# Altium schematic sheet DE-290817_02.SchDoc: Digital I/O - Power - Com
size A3; Author: eldar6776@hotmail.com; DrawnBy: Eldar Dedić; Organization: I-MEDIA GROUP d.o.o.; Address1: Topal Osman Paše 18; Address2: 71000 Sarajevo; Address3: Federacija BiH; Address4: Bosna i Hercegovina; DocumentNumber: 2; Revision: 001; SheetNumber: 2; SheetTotal: 2; DocumentName: DE-290817; ProjectName: Hotel Room Access Controller Unit
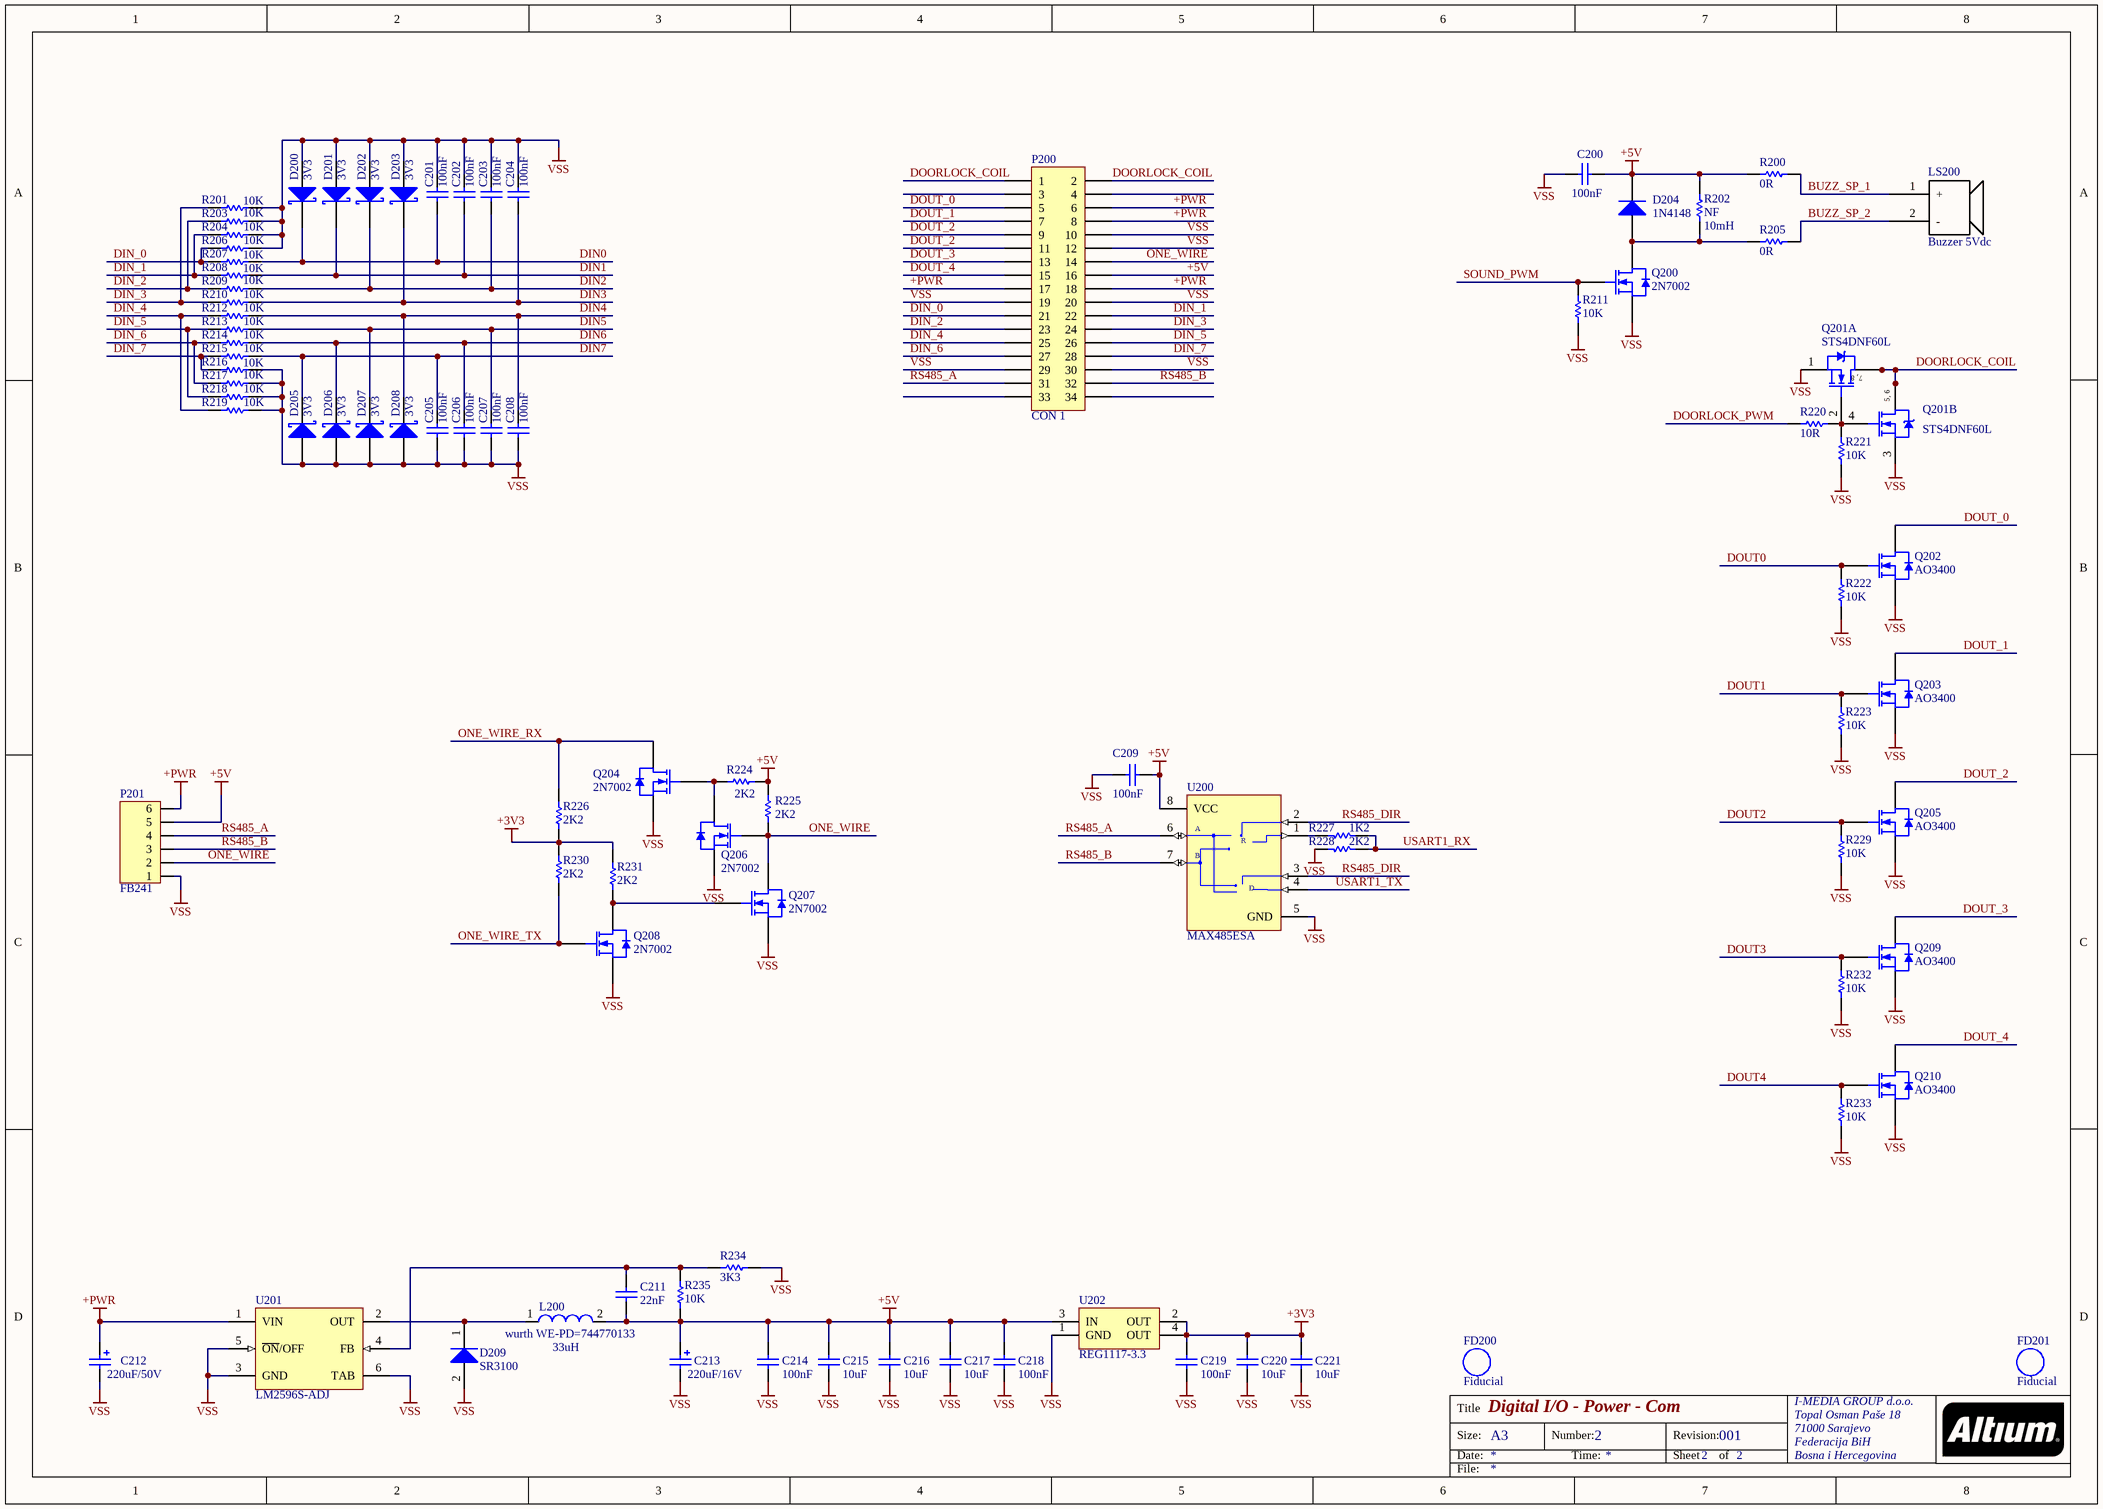
[diagram p0: DE-290817_02.SchDoc]

## Parts
C200  100nF  [0603]
C201  100nF  [0603]
C202  100nF  [0603]
C203  100nF  [0603]
C204  100nF  [0603]
C205  100nF  [0603]
C206  100nF  [0603]
C207  100nF  [0603]
C208  100nF  [0603]
C209  100nF  [0603]
C211  22nF  [0603]
C212  220uF/50V  [EEEHA1H101P]
C213  220uF/16V  [EEEHA1H101P]
C214  100nF  [0603]
C215  10uF  [0805]
C216  10uF  [0805]
C217  10uF  [0805]
C218  100nF  [0603]
C219  100nF  [0603]
C220  10uF  [0805]
C221  10uF  [0805]
D200  3V3  [SOD323]
D201  3V3  [SOD323]
D202  3V3  [SOD323]
D203  3V3  [SOD323]
D204  1N4148  [SOD323]
D205  3V3  [SOD323]
D206  3V3  [SOD323]
D207  3V3  [SOD323]
D208  3V3  [SOD323]
D209  SR3100  [ONSC-SMA-2-403D-02_C_V]
FD200  Fiducial  [Fiducial]  (no BOM)
FD201  Fiducial  [Fiducial]  (no BOM)
L200  wurth WE-PD=744770133  value 33uH  [WE-PD-XL]
LS200  Buzzer 5Vdc  [BUZZER]
P200  CON 1  [HDR2X17]
P201  FB241  [FB241_6]
Q200  2N7002  [SOT23_N]
Q201  STS4DNF60L  [ONSC-SOIC-8-751-07_V]  (parts A,B of 2)
Q202  AO3400  [SOT23_N]
Q203  AO3400  [SOT23_N]
Q204  2N7002  [SOT23_N]
Q205  AO3400  [SOT23_N]
Q206  2N7002  [SOT23_N]
Q207  2N7002  [SOT23_N]
Q208  2N7002  [SOT23_N]
Q209  AO3400  [SOT23_N]
Q210  AO3400  [SOT23_N]
R200  0R  [ERA-0603]
R201  10K  [ERA-0603]
R202  NF  value 10mH  [RD3.2x1.7]
R203  10K  [ERA-0603]
R204  10K  [ERA-0603]
R205  0R  [ERA-0603]
R206  10K  [ERA-0603]
R207  10K  [ERA-0603]
R208  10K  [ERA-0603]
R209  10K  [ERA-0603]
R210  10K  [ERA-0603]
R211  10K  [ERA-0603]
R212  10K  [ERA-0603]
R213  10K  [ERA-0603]
R214  10K  [ERA-0603]
R215  10K  [ERA-0603]
R216  10K  [ERA-0603]
R217  10K  [ERA-0603]
R218  10K  [ERA-0603]
R219  10K  [ERA-0603]
R220  10R  [ERA-0603]
R221  10K  [ERA-0603]
R222  10K  [ERA-0603]
R223  10K  [ERA-0603]
R224  2K2  [ERA-0603]
R225  2K2  [ERA-0603]
R226  2K2  [ERA-0603]
R227  1K2  [ERA-0603]
R228  2K2  [ERA-0603]
R229  10K  [ERA-0603]
R230  2K2  [ERA-0603]
R231  2K2  [ERA-0603]
R232  10K  [ERA-0603]
R233  10K  [ERA-0603]
R234  3K3  [ERA-0603]
R235  10K  [ERA-0603]
U200  MAX485ESA  [NSO8_M]
U201  LM2596S-ADJ  [TS5B_N]
U202  REG1117-3.3  [ZZ311]

## Nets
+3V3: C219.2 C220.2 C221.2 R226.1 R230.2 R231.2 U202.2(OUT) U202.4(OUT)
+5V: C200.1 C209.2 C211.1 C213.1 C214.2 C215.2 C216.2 C217.2 C218.2 D204.1(K) L200.2 P200.16 P201.5 R200.2 R202.2 R224.1 R225.2 R235.2 U200.8(VCC) U202.3(IN)
+PWR: C212.1 P200.6 P200.8 P200.17 P200.18 P201.6 U201.1(VIN)
VSS: C200.2 C201.1 C202.1 C203.1 C204.1 C205.1 C206.1 C207.1 C208.1 C209.1 C212.2 C213.2 C214.1 C215.1 C216.1 C217.1 C218.1 C219.1 C220.1 C221.1 D200.2(A) D201.2(A) D202.2(A) D203.2(A) D205.2(A) D206.2(A) D207.2(A) D208.2(A) D209.2(A) P200.10 P200.12 P200.19 P200.20 P200.29 P200.30 P201.1 Q200.2(S) Q201.1(S1) Q201.3(S2) Q202.2(S) Q203.2(S) Q204.2(S) Q205.2(S) Q206.2(S) Q207.2(S) Q208.2(S) Q209.2(S) Q210.2(S) R201.2 R203.2 R204.2 R206.2 R211.1 R216.2 R217.2 R218.2 R219.2 R221.2 R222.1 R223.1 R228.2 R229.1 R232.1 R233.1 R234.2 U200.5(GND) U201.3(GND) U201.5(~{ON}/OFF) U201.6(TAB) U202.1(GND)
BUZZ_SP_1: LS200.1(+) R200.1
BUZZ_SP_2: LS200.2(-) R205.1
DIN0: C201.2 D200.1(K) R207.2
DIN1: C202.2 D201.1(K) R208.2
DIN2: C203.2 D202.1(K) R209.2
DIN3: C204.2 D203.1(K) R210.2
DIN4: C208.2 D208.1(K) R212.2
DIN5: C207.2 D207.1(K) R213.2
DIN6: C206.2 D206.1(K) R214.2
DIN7: C205.2 D205.1(K) R215.2
DIN_0: P200.21 R206.1 R207.1
DIN_1: P200.22 R204.1 R208.1
DIN_2: P200.23 R203.1 R209.1
DIN_3: P200.24 R201.1 R210.1
DIN_4: P200.25 R212.1 R219.1
DIN_5: P200.26 R213.1 R218.1
DIN_6: P200.27 R214.1 R217.1
DIN_7: P200.28 R215.1 R216.1
DOORLOCK_COIL: P200.1 P200.2 Q201.5(D2) Q201.6(D2) Q201.7(D1) Q201.8(D1)
DOORLOCK_PWM: R220.2
DOUT0: Q202.1(G) R222.2
DOUT1: Q203.1(G) R223.2
DOUT2: Q205.1(G) R229.2
DOUT3: Q209.1(G) R232.2
DOUT4: Q210.1(G) R233.2
DOUT_0: P200.5 Q202.3(D)
DOUT_1: P200.7 Q203.3(D)
DOUT_2: P200.9 P200.11 Q205.3(D)
DOUT_3: P200.13 Q209.3(D)
DOUT_4: P200.15 Q210.3(D)
ONE_WIRE: P200.14 P201.2 Q206.1(G) Q207.3(D) R225.1
ONE_WIRE_RX: Q204.3(D) R226.2
ONE_WIRE_TX: Q208.1(G) R230.1
RS485_A: P200.31 P201.4 U200.6(A)
RS485_B: P200.32 P201.3 U200.7(B)
RS485_DIR: U200.2(~{RE}) U200.3(DE)
SOUND_PWM: Q200.1(G) R211.2
USART1_RX: R227.2 R228.1
USART1_TX: U200.4(DI)
NetC211_2: C211.2 R234.1 R235.1 U201.4(FB)
NetD204_2: D204.2(A) Q200.3(D) R202.1 R205.2
NetD209_1: D209.1(K) L200.1 U201.2(OUT)
NetQ201_2: Q201.2(G1) Q201.4(G2) R220.1 R221.1
NetQ204_1: Q204.1(G) Q206.3(D) R224.2
NetQ207_1: Q207.1(G) Q208.3(D) R231.1
NetR227_1: R227.1 U200.1(RO)

Not connected (* = marked no-connect by the designer): P200 3 4 33 34

## Notes on the sheet
- Title
- Size:
- Date:
- A3
- Number:
- Time:
- Revision:
- Sheet
- of
- File:
- (in symbol MAX485ESA) R; D
- (in symbol NVMD6N04R2G, part A) 7, 8
- (in symbol NVMD6N04R2G, part B) 5, 6

## Library data of the parts
C200-C209 C211 C214 C218 C219 = C0603: Ceramic Chip Capacitor - Standard; Note: Footprint corresponds to dimensions for bulk cassette packaging. This case size has tightened tolerances.; Published: 17-Jul-2002; LatestRevisionDate: 19-Mar-2004; LatestRevisionNote: Silkscreen size reduced.; DatasheetDocument: Mar-2001; PackageDocument: Mar-2001; PackageReference: 0603; Publisher: Altium Limited; Code_JEITA: 0603; Code_IPC: 1608 [0603]; ComponentLink1Description: Manufacturer Link; ComponentLink1URL: http://www.kemet.com/; ComponentLink2Description: Datasheet; ComponentLink2URL: http://www.kemet.com/kemet/web/homepage/kechome.nsf/vapubfilesname/F3102TA.pdf/$file/F3102TA.pdf
  C200-C209 C214 C218 C219: Value: 100nF
  C211: Value: 22nF
C212 = EEEHA1H101P: Aluminum Electrolytic Capacitors (SMD Type); Value: 220uF/50V
C213 = EEEHA1C221P: Aluminum Electrolytic Capacitors (SMD Type); Value: 220uF/16V
C215-C217 C220 C221 = C0805: Ceramic Chip Capacitor - Standard; Note: Footprint corresponds to dimensions for bulk cassette packaging. This case size has tightened tolerances.; Published: 17-Jul-2002; LatestRevisionDate: 19-Mar-2004; LatestRevisionNote: Silkscreen size reduced.; DatasheetDocument: Mar-2001; PackageDocument: Mar-2001; PackageReference: 0805; Publisher: Altium Limited; Code_JEITA: 0805; Code_IPC: 2012[0805]; ComponentLink1Description: Manufacturer Link; ComponentLink1URL: http://www.kemet.com/; ComponentLink2Description: Datasheet; ComponentLink2URL: http://www.kemet.com/kemet/web/homepage/kechome.nsf/vapubfilesname/F3102TA.pdf/$file/F3102TA.pdf; Value: 10uF
D200-D203 D205-D208 = 1PS76SB10: Schottky Barrier Diode; Published: 17-Sep-2003; LatestRevisionDate: 19-Mar-2004; LatestRevisionNote: Silkscreen size reduced.; DatasheetVersion: 14-Oct-1996; PackageVersion: May-1999; PackageReference: SOD323; Publisher: Altium Limited; PackageDescription: SOD-323/SC-76; 2 Leads; Body 1.7 x 1.3 mm, (LxW); ComponentLink1Description: Manufacturer Link; ComponentLink1URL: http://www.semiconductors.philips.com/; ComponentLink2Description: Datasheet; ComponentLink2URL: http://www.semiconductors.philips.com/acrobat/datasheets/1PS76SB10_2.pdf
D204 = BAS321: General-purpose Diode; Published: 17-Sep-2003; LatestRevisionDate: 19-Mar-2004; LatestRevisionNote: Silkscreen size reduced.; DatasheetVersion: 9-Feb-1999; PackageVersion: May-1999; PackageReference: SOD323; Publisher: Altium Limited; PackageDescription: SOD-323/SC-76; 2 Leads; Body 1.7 x 1.3 mm, (LxW); ComponentLink1Description: Manufacturer Link; ComponentLink1URL: http://www.semiconductors.philips.com/; ComponentLink2Description: Datasheet; ComponentLink2URL: http://www.semiconductors.philips.com/acrobat/datasheets/BAS321_2.pdf; Value: 1N4148
D209 = MBRA320T3G: Schottky Power Rectifier, 2-Pin SMA, Pb-Free, Tape and Reel; Manufacturer: On Semiconductor; Configuration: Single; IFSM Max (A): 80; DatasheetVersion: Rev. 0; PackageVersion: Rev. C, 08/2005; PackageReference: SMA-2-403D-02_C; PackageDescription: 2-Pin Small Molded Package, J-Bend Lead, Body 4.315 x 2.605 mm; Supplier 1: Digi-Key; Supplier Part Number 1: MBRA320T3GOSTR-ND; Supplier 2: Digi-Key; Supplier Part Number 2: MBRA320T3GOSCT-ND; Supplier 3: Digi-Key; Supplier Part Number 3: MBRA320T3GOSDKR-ND; Supplier 4: Farnell; Supplier Part Number 4: 2101200; Supplier 5: Newark; Supplier Part Number 5: 95M6589; Supplier 6: Mouser; Supplier Part Number 6: 863-MBRA320T3G; Packing: Tape and Reel; RoHS: TRUE; Mounting Technology: Surface Mount; PartNumber: MBRA320T3G; ComponentLink1Description: Manufacturer URL; ComponentLink1URL: http://www.onsemi.com/; ComponentLink2Description: Datasheet; ComponentLink2URL: http://www.onsemi.cn/pub_link/Collateral/MBRA320-D.PDF; ComponentLink3Description: Package Specification; ComponentLink3URL: http://www.onsemi.com/pub_link/Collateral/MBRA320-D.PDF; Value: SR3100
FD200 FD201 = Fiduchial: Fiduchial mark
L200 = 744770133: SMD-Shielded Power Inductor WE-PD, L = 33 µH; Inductance: 33.0 µH; DatasheetVersion: ver 5, Oct-2004; PackageReference: WE-PD-XL; PackageDescription: SMD Inductor, 2-Leads, Body 12.0 x 12.0 mm; PartNumber: 744770133; ComponentLink1Description: Manufacturer URL; ComponentLink1URL: http://www.we-online.com; ComponentLink2Description: Datasheet; ComponentLink2URL: http://www.we-online.de/katalog/media/pdf/744770133.pdf
LS200 = BUZZER: 5Vdc PCB buzzer
P200 = Header 17X2: Header, 17-Pin, Dual row; LatestRevisionDate: 17-Jul-2002; LatestRevisionNote: Re-released for DXP Platform.; Publisher: Altium Limited
P201 = TERMINAL BLOCK 6: PCB MOUNT TERMINAL BLOCK 2.5MM PITCH
Q200 Q202 Q203 Q205 Q209 Q210 = 2N7002: N-channel Enhancement Mode Field-effect Transistor; Published: 17-Sep-2003; LatestRevisionDate: 12-Dec-2006; LatestRevisionNote: IPC-7351 Footprint Added.; DatasheetVersion: 27-Jul-2000; PackageVersion: May-1999; PackageReference: SOT23; Publisher: Altium Limited; PackageDescription: 3-Pin SOT-23 Package 0.95 mm Pitch, 2.3 mm Lead Span; ComponentLink1Description: Manufacturer Link; ComponentLink1URL: http://www.semiconductors.philips.com/; ComponentLink2Description: Datasheet; ComponentLink2URL: http://www.semiconductors.philips.com/acrobat/datasheets/2N7002_4.pdf
  Q200: Value: 2N7002
Q201 = NVMD6N04R2G: Power MOSFET, 40 V, 5.8 A, Dual N-Channel, 8-Pin SOIC, Pb-Free, Tape and Reel; Manufacturer: On Semiconductor; Channel Polarity: N Channel; Ciss Typ (pF): 723; Coss Typ (pF): 156; Crss Typ (pF): 53; ID Max (A): 5.8; Qrr Typ (nC): 20; V(BR)DSS Min (V): 40; VGS(th) Max (V): 3; DatasheetVersion: Rev. 2; PackageVersion: Rev. AK, 02/2011; PackageReference: SOIC-8-751-07; PackageDescription: 8-Pin Small Outline Integrated Circuit, Body 4.9 x 3.9 mm, Pitch 1.27 mm; Configuration: Dual; Package Type: SOIC-8; Packing: Tape and Reel; RoHS: Pb-Free; VGS Max (V): 20; Mounting Technology: Surface Mount; PartNumber: NVMD6N04R2G; ComponentLink1Description: Manufacturer URL; ComponentLink1URL: http://www.onsemi.com/; ComponentLink2Description: Datasheet; ComponentLink2URL: http://www.onsemi.com/pub_link/Collateral/NTMD6N04R2-D.PDF; ComponentLink3Description: Package Specification; ComponentLink3URL: http://www.onsemi.com/pub_link/Collateral/751-07.PDF
Q204 Q206-Q208 = BSS123: N-channel Enhancement Mode Vertical D-MOSFET; Published: 17-Sep-2003; LatestRevisionDate: 12-Dec-2006; LatestRevisionNote: IPC-7351 Footprint Added.; DatasheetVersion: Apr-1995; PackageVersion: May-1999; PackageReference: SOT23; Publisher: Altium Limited; PackageDescription: 3-Pin SOT-23 Package 0.95 mm Pitch, 2.3 mm Lead Span; ComponentLink1Description: Manufacturer Link; ComponentLink1URL: http://www.semiconductors.philips.com/; ComponentLink2Description: Datasheet; ComponentLink2URL: http://www.semiconductors.philips.com/acrobat/datasheets/BSS123_3.pdf
R200 R201 R203-R235 = ERAV: Metal Film Thermosensitive Chip Resistor, 0.56 Ohm to 10k Ohm Range, 5% Tolerance, 0603 Size, 0.063 W; Note: If flow soldering, adjust pad width of PCB Footprint to 0.7 - 0.8 times the width of the resistor.; Published: 17-Dec-2003; LatestRevisionDate: 19-Mar-2004; LatestRevisionNote: Silkscreen size reduced.; PackageDocument: Mar-2003; PackageReference: ERA-0603; Publisher: Altium Limited; Code_IPC: 1608 [0603]; ComponentLink1Description: Manufacturer Link; ComponentLink1URL: http://www.panasonic.com/industrial/components/resistive_products.htm; ComponentLink2Description: Datasheet; ComponentLink2URL: http://www.panasonic.com/industrial/components/pdf/AOF0000CE1.pdf
  R200 R205: Value: 0R
  R211 R221-R223 R229 R232 R233: Value: 10K
  R220: Value: 10R
  R224 R225 R228 R230 R231: Value: 2K2
  R227: Value: 1K2
R202 = ERD6FC: Flame-Retardant Fuse Type Carbon Film Resistor, 4.7 Ohm to 1k Ohm Range, 2% and 5% Tolerance, 0.166 W; Published: 17-Dec-2003; PackageReference: RD3.2x1.7; Publisher: Altium Limited; ComponentLink1Description: Manufacturer Link; ComponentLink1URL: http://www.panasonic.com/industrial/components/resistive_products.htm; ComponentLink2Description: Datasheet; ComponentLink2URL: http://www.panasonic.com/industrial/components/pdf/AOB0000CE5.pdf
U200 = MAX485ESA: Low-Power, Slew-Rate-Limited RS-485/RS-422 Transceiver; Published: 16-Jan-2001; LatestRevisionDate: 13-Apr-2006; LatestRevisionNote: IPC-7351 Footprint Added.; DatasheetVersion: Feb-1996; PackageReference: NSO8; Publisher: Altium Limited; PackageDescription: 8-Pin Small Outline Integrated Circuit 1.27 mm Pitch; Code_JEDEC: MS-012-AA; Code_IPC: SOIC127P600-8; ComponentLink1Description: Manufacturer Link; ComponentLink1URL: http://www.maxim-ic.com/; ComponentLink2Description: Datasheet; ComponentLink2URL: http://pdfserv.maxim-ic.com/en/ds/MAX1487-MAX491.pdf
U201 = LM2596S-ADJ: SIMPLE SWITCHER® Power Converter 150 KHz 3A Step-Down Voltage Regulator, 5-pin TO-263; Manufacturer: National Semiconductor; PackageTopMarking: NSUZXYTTE#*LM2596S*-ADJ P+; PowerWise: N; High-Reliability: Y; DatasheetVersion: May-2002; PackageVersion: revD, Apr-2005; PackageReference: TS5B; PackageDescription: TO-263, Molded, .400 x .390 x .180in, 5 Lead, .067in Pitch, Surface Mount; PartNumber: LM2596S-ADJ; RoHS: N; PinCount: 5; CompType: Switcher; Code_JEDEC: MO-169-AB; ComponentLink1Description: Manufacturer URL; ComponentLink1URL: http://www.national.com/; ComponentLink2Description: LM2596 Datasheet; ComponentLink2URL: http://www.national.com/ds/LM/LM2596.pdf; ComponentLink3Description: LM2596 Web Page; ComponentLink3URL: http://www.national.com/pf/LM/LM2596.html; ComponentLink4Description: TS5B Package Page; ComponentLink4URL: http://www.national.com/packaging/folders/ts5b.html
U202 = REG1117-3.3: 800mA and 1A Low Dropout Positive Regulator 2.85V, 3.3V, 5V, and Adjustable; Published: 8-Jun-2000; LatestRevisionDate: 17-Jul-2002; LatestRevisionNote: Re-released for DXP Platform.; DatasheetVersion: Sep-1997; PackageVersion: revC; PackageReference: ZZ311; Publisher: Altium Limited; PackageDescription: SOT-223/SC-73; 4 Leads; Body 6.7 x 7.3 mm, inc. leads (LxW max); ComponentLink1Description: Manufacturer Link; ComponentLink1URL: http://www.ti.com/; ComponentLink2Description: Datasheet; ComponentLink2URL: http://www-s.ti.com/sc/ds/REG1117.pdf